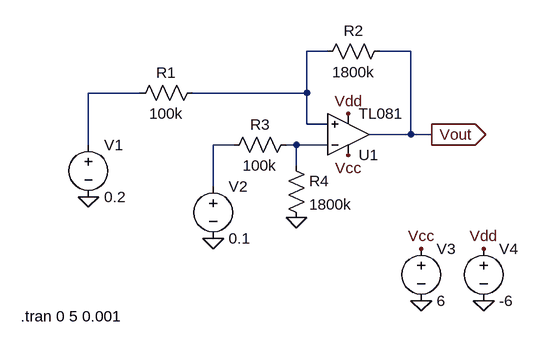
[diagram p0: schematic Offset_med_forstærkning.asc]
Offset_med_forstærkning.asc, the LTspice schematic file:
Version 4
SHEET 1 880 680
WIRE 208 0 176 0
WIRE 336 0 288 0
WIRE -80 64 -160 64
WIRE 176 64 176 0
WIRE 176 64 0 64
WIRE 176 112 176 64
WIRE 208 112 176 112
WIRE 336 128 336 0
WIRE 336 128 272 128
WIRE 368 128 336 128
WIRE -160 144 -160 64
WIRE 64 144 32 144
WIRE 160 144 144 144
WIRE 208 144 160 144
WIRE 160 176 160 144
WIRE 32 208 32 144
FLAG 32 288 0
FLAG -160 224 0
FLAG 352 384 0
FLAG 448 384 0
FLAG 352 304 Vcc
FLAG 448 304 Vdd
FLAG 368 128 Vout
IOPIN 368 128 Out
FLAG 160 256 0
FLAG 240 96 Vdd
FLAG 240 160 Vcc
SYMBOL voltage -160 128 R0
WINDOW 123 0 0 Left 2
WINDOW 39 0 0 Left 2
SYMATTR InstName V1
SYMATTR Value 0.2
SYMBOL voltage 352 288 R0
WINDOW 123 0 0 Left 2
WINDOW 39 0 0 Left 2
SYMATTR InstName V3
SYMATTR Value 6
SYMBOL voltage 448 288 R0
WINDOW 123 0 0 Left 2
WINDOW 39 0 0 Left 2
SYMATTR InstName V4
SYMATTR Value -6
SYMBOL res -96 80 R270
WINDOW 0 32 56 VTop 2
WINDOW 3 0 56 VBottom 2
SYMATTR InstName R1
SYMATTR Value 100k
SYMBOL res 192 16 R270
WINDOW 0 32 56 VTop 2
WINDOW 3 0 56 VBottom 2
SYMATTR InstName R2
SYMATTR Value 1800k
SYMBOL res 48 160 R270
WINDOW 0 32 56 VTop 2
WINDOW 3 0 56 VBottom 2
SYMATTR InstName R3
SYMATTR Value 100k
SYMBOL res 144 160 R0
SYMATTR InstName R4
SYMATTR Value 1800k
SYMBOL voltage 32 192 R0
WINDOW 123 0 0 Left 2
WINDOW 39 0 0 Left 2
SYMATTR InstName V2
SYMATTR Value 0.1
SYMBOL Opamps\\TL081 240 192 M180
SYMATTR InstName U1
TEXT -264 408 Left 2 !.tran 0 5 0.001

The netlist it stands for:
* Offset_med_forstærkning.asc
V1 N002 0 0.2
V3 Vcc 0 6
V4 Vdd 0 -6
R1 N002 N001 100k
R2 N001 Vout 1800k
R3 N003 N004 100k
R4 N004 0 1800k
V2 N003 0 0.1
XU1 N001 N004 Vcc Vdd Vout TL081  ; pins In+ In- V+ V- OUT
.tran 0 5 0.001
.backanno
.end